# Altium project ESP32C6_module.PrjPcb
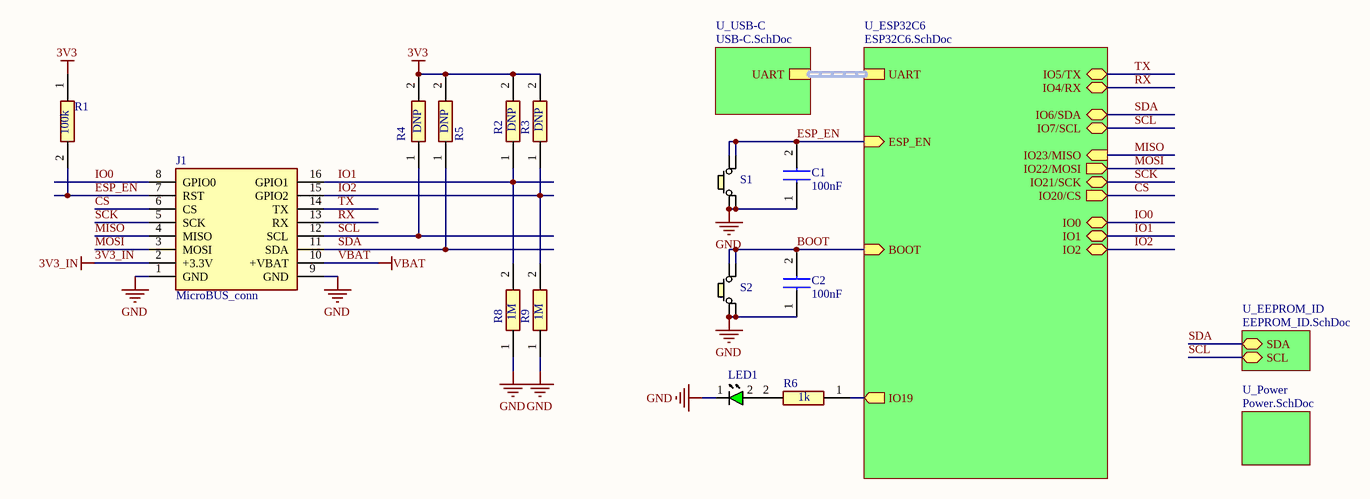
[diagram p0: main.SchDoc]
Revision: 1.3; Author: Evžen Šteif
5 sheets, 77 parts. Net scope: hierarchical (ports join the sheet entries above them; power ports are global).
Board file: ESP32C6_module.PcbDoc
Sheets:
  main.SchDoc
    U_ESP32C6 = ESP32C6.SchDoc
    U_USB-C = USB-C.SchDoc
    U_EEPROM_ID = EEPROM_ID.SchDoc
    U_Power = Power.SchDoc

## Sheet main.SchDoc: ESP
size A4; Author: Evžen Šteif; SheetNumber: 1; SheetTotal: 5

### Parts
C1  100nF  [CAPC1005X70N]
C2  100nF  [CAPC1005X70N]
J1  MicroBUS_conn  [MicroBUS_header]
LED1  150060GS75000  [LEDC1608X80N]  (value not drawn)
R1  100k  [RESC1005X35N]
R2  DNP  [RESC1005X40N]
R3  DNP  [RESC1005X40N]
R4  DNP  [RESC1005X35N]
R5  DNP  [RESC1005X35N]
R6  1k  [RESC1005X35N]
R8  1M  [RESC1005X40N]
R9  1M  [RESC1005X40N]
S1  KMR731NG_LFS  [KMR731NGLFS]  (value not drawn)
S2  KMR731NG_LFS  [KMR731NGLFS]  (value not drawn)

### Sub-sheets
U_EEPROM_ID = EEPROM_ID.SchDoc: SDA (bidir), SCL (bidir)
U_ESP32C6 = ESP32C6.SchDoc: ESP_EN (in), BOOT (in), IO21/SCK (bidir), IO22/MOSI (out), IO23/MISO (in), IO20/CS (out), IO6/SDA (bidir), IO7/SCL (bidir), IO4/RX (bidir), IO0 (bidir), IO1 (bidir), IO19 (out), UART (harness UART), IO5/TX (bidir), IO2 (bidir)
U_Power = Power.SchDoc: no entries
U_USB-C = USB-C.SchDoc: UART (harness UART)

### Nets
3V3: R1.1 R2.2 R3.2 R4.2 R5.2  [project net STAB_3V3]
3V3_IN: J1.2(+3.3V)
GND: C1.1 C2.1 J1.1(GND) J1.9(GND) LED1.1(K) R8.1 R9.1 S1.1 S1.2 S2.1 S2.2
VBAT: J1.10(+VBAT)
BOOT: C2.2 S2.3 S2.4 ; sheet U_ESP32C6/BOOT
CS: J1.6(CS) ; sheet U_ESP32C6/IO20/CS
ESP_EN: C1.2 J1.7(RST) R1.2 S1.3 S1.4 ; sheet U_ESP32C6/ESP_EN
IO0: J1.8(GPIO0) ; sheet U_ESP32C6/IO0
IO1: J1.16(GPIO1) R2.1 R8.2 ; sheet U_ESP32C6/IO1
IO2: J1.15(GPIO2) R3.1 R9.2 ; sheet U_ESP32C6/IO2
MISO: J1.4(MISO) ; sheet U_ESP32C6/IO23/MISO
MOSI: J1.3(MOSI) ; sheet U_ESP32C6/IO22/MOSI
RX: J1.13(RX) ; sheet U_ESP32C6/IO4/RX
SCK: J1.5(SCK) ; sheet U_ESP32C6/IO21/SCK
SCL: J1.12(SCL) R4.1 ; sheet U_ESP32C6/IO7/SCL, sheet U_EEPROM_ID/SCL
SDA: J1.11(SDA) R5.1 ; sheet U_ESP32C6/IO6/SDA, sheet U_EEPROM_ID/SDA
TX: J1.14(TX) ; sheet U_ESP32C6/IO5/TX
NetIC3_25: R6.1 ; sheet U_ESP32C6/IO19
NetLED1_2: LED1.2(A) R6.2

### Buses and harness runs
harness sheet U_ESP32C6/UART = sheet U_USB-C/UART

### Notes on the sheet
- Title:
- Date:
- Project:
- Type:
- Schematic
- Variant:
- Revision:
- Sheet
- of
- Author:
- Evžen Šteif
- Size:
- A4

### Library data of the parts
C1 C2 = GRM155R61A104KA01D: Capacitor; Manufacturer_Name: Murata Electronics; Datasheet Link: https://search.murata.co.jp/Ceramy/image/img/A01X/G101/ENG/GRM155R61A104KA01-02A.pdf; Height: 0.7mm; Manufacturer_Part_Number: GRM155R61A104KA01D; Mouser Part Number: 81-GRM155R61A104KA01; Mouser Price/Stock: https://www.mouser.co.uk/ProductDetail/Murata-Electronics/GRM155R61A104KA01D?qs=5bAuhL3RhmNZw0v59AqOJA%3D%3D; Arrow Part Number: GRM155R61A104KA01D; Arrow Price/Stock: https://www.arrow.com/en/products/grm155r61a104ka01d/murata-manufacturing?utm_currency=USD&region=europe
J1 = MicroBUS_conn: Connector; Manufacturer_Name: Harwin; Manufacturer_Part_Number: M20-9730845; Datasheet Link: https://cdn.harwin.com/pdfs/M20-973.pdf; Height: 9.54mm; Mouser Part Number: 855-M20-9730845; Mouser Price/Stock: https://www.mouser.co.uk/ProductDetail/Harwin/M20-9730845?qs=%252Bk6%2F5FB6qrnRfgIEPS4Dkw%3D%3D
LED1 = 150060GS75000: LED; Manufacturer_Name: Wurth Elektronik; Datasheet Link: https://componentsearchengine.com/Datasheets/2/150060GS75000.pdf; Height: 0.8mm; Manufacturer_Part_Number: 150060GS75000; Mouser Part Number: 710-150060GS75000; Mouser Price/Stock: https://www.mouser.co.uk/ProductDetail/Wurth-Elektronik/150060GS75000?qs=LlUlMxKIyB0UYkq5lDO8nA%3D%3D
R1 = RT0402FRE07100KL: Resistor; Manufacturer_Name: KEMET; Datasheet Link: https://www.yageo.com/upload/media/product/productsearch/datasheet/rchip/PYu-RT_1-to-0.01_RoHS_L_11.pdf; Height: 0.35mm; Manufacturer_Part_Number: RT0402FRE07100KL; Mouser Part Number: 603-RT0402FRE07100KL; Mouser Price/Stock: https://www.mouser.co.uk/ProductDetail/YAGEO/RT0402FRE07100KL?qs=BXCcY9r%252B08CxTvf5JB1kiw%3D%3D; Arrow Part Number: RT0402FRE07100KL; Arrow Price/Stock: https://www.arrow.com/en/products/rt0402fre07100kl/yageo
R2 R3 R8 R9 = RC0402FR-071ML: Resistor; Manufacturer_Name: YAGEO; Datasheet Link: https://componentsearchengine.com/Datasheets/2/RC0402FR-071ML.pdf; Height: 0.4mm; Manufacturer_Part_Number: RC0402FR-071ML; Mouser Part Number: 603-RC0402FR-071ML; Mouser Price/Stock: https://www.mouser.co.uk/ProductDetail/YAGEO/RC0402FR-071ML?qs=V1yeUXFNrknfoI4987wfBQ%3D%3D; Arrow Part Number: RC0402FR-071ML; Arrow Price/Stock: https://www.arrow.com/en/products/rc0402fr-071ml/yageo?region=nac
R4 R5 = RT0402FRE075K1L: Resistor; Manufacturer_Name: YAGEO; Datasheet Link: https://www.yageo.com/upload/media/product/app/datasheet/rchip/pyu-rt_1-to-0.01_rohs_l.pdf; Height: 0.35mm; Manufacturer_Part_Number: RT0402FRE075K1L; Mouser Part Number: RT0402FRE075K1L; Mouser Price/Stock: https://www.mouser.co.uk/ProductDetail/YAGEO/RT0402FRE07100RL?qs=BXCcY9r%252B08AcvLZjF7vcwQ%3D%3D
R6 = RT0402FRE071KL: Resistor; Manufacturer_Name: KEMET; Datasheet Link: https://www.yageo.com/upload/media/product/productsearch/datasheet/rchip/PYu-RT_1-to-0.01_RoHS_L_11.pdf; Height: 0.35mm; Manufacturer_Part_Number: RT0402FRE071KL; Mouser Part Number: RT0402FRE071KL; Mouser Price/Stock: https://www.mouser.co.uk/ProductDetail/YAGEO/RT0402FRE07100KL?qs=BXCcY9r%252B08CxTvf5JB1kiw%3D%3D; Arrow Part Number: RT0402FRE07100KL; Arrow Price/Stock: https://www.arrow.com/en/products/rt0402fre07100kl/yageo
S1 S2 = KMR731NG_LFS: Switch; Manufacturer_Name: C & K COMPONENTS; Manufacturer_Part_Number: KMR731NG LFS; Datasheet Link: https://www.ckswitches.com/media/1908/kmr7.pdf; Mouser Part Number: 611-KMR731NGLFS; Mouser Price/Stock: https://www.mouser.com/Search/Refine.aspx?Keyword=611-KMR731NGLFS; Arrow Part Number: KMR731NG LFS; Arrow Price/Stock: https://www.arrow.com/en/products/kmr731nglfs/ck

## Sheet ESP32C6.SchDoc
size A4; SheetNumber: 3; SheetTotal: 5
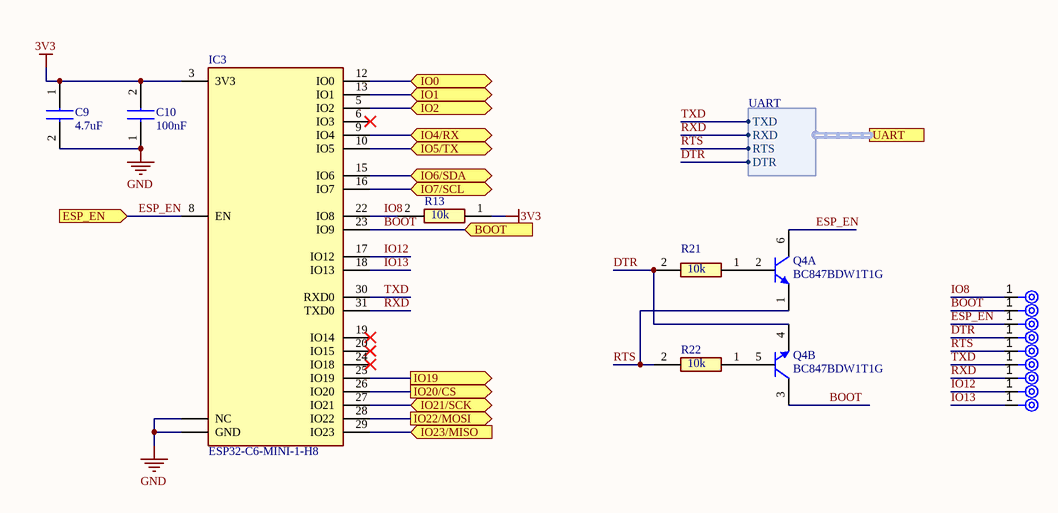
[diagram p1: ESP32C6.SchDoc]

### Parts
C9  4.7uF  [CAPC1608X90N]
C10  100nF  [CAPC1005X70N]
IC3  ESP32-C6-MINI-1-H8  [ESP32C6MINI1H8]
Q4  BC847BDW1T1G  [ONSC-SOT-363-6-419B-02_W_V]  (parts A,B of 2)
R13  10k  [RESC1005X35N]
R21  10k  [RESC1005X35N]
R22  10k  [RESC1005X35N]
TP4  TPAD6R  [TP06R]  (value not drawn)  (no BOM)
TP5  TPAD6R  [TP06R]  (value not drawn)  (no BOM)
TP6  TPAD6R  [TP06R]  (value not drawn)  (no BOM)
TP7  TPAD6R  [TP06R]  (value not drawn)  (no BOM)
TP8  TPAD6R  [TP06R]  (value not drawn)  (no BOM)
TP9  TPAD6R  [TP06R]  (value not drawn)  (no BOM)
TP10  TPAD6R  [TP06R]  (value not drawn)  (no BOM)
TP11  TPAD6R  [TP06R]  (value not drawn)  (no BOM)
TP12  TPAD6R  [TP06R]  (value not drawn)  (no BOM)

### Ports
BOOT (in, see main[3B]), ESP_EN (in, see main[3B]), IO0 (bidir, see main[4B]), IO1 (bidir, see main[4B]), IO2 (bidir, see main[4B]), IO4/RX (bidir, see main[4B]), IO5/TX (bidir, see main[4B]), IO6/SDA (bidir, see main[4B]), IO7/SCL (bidir, see main[4B]), IO19 (out, see main[3C]), IO20/CS (out, see main[4B]), IO21/SCK (bidir, see main[4B]), IO22/MOSI (out, see main[4B]), IO23/MISO (in, see main[4B]), UART (harness UART, see main[3B], USB-C[8B])

### Harnesses
UART: TXD, RXD, RTS, DTR

### Nets
3V3: C9.1 C10.2 IC3.3(3V3) R13.1  [project net STAB_3V3]
GND: C9.2 C10.1 IC3.1(GND) IC3.21(NC)
BOOT: IC3.23(IO9) Q4.3(C) TP5.1(TP) ; port BOOT
CS: IC3.26(IO20) ; port IO20/CS
DTR: Q4.4(E) R21.2 TP7.1(TP) ; port UART.DTR
ESP_EN: IC3.8(EN) Q4.6(C) TP6.1(TP) ; port ESP_EN
IO0: IC3.12(IO0) ; port IO0
IO1: IC3.13(IO1) ; port IO1
IO2: IC3.5(IO2) ; port IO2
IO8: IC3.22(IO8) R13.2 TP4.1(TP)
IO12: IC3.17(IO12) TP11.1(TP)
IO13: IC3.18(IO13) TP12.1(TP)
MISO: IC3.29(IO23) ; port IO23/MISO
MOSI: IC3.28(IO22) ; port IO22/MOSI
RTS: Q4.1(E) R22.2 TP8.1(TP) ; port UART.RTS
RX: IC3.9(IO4) ; port IO4/RX
RXD: IC3.31(TXD0) TP10.1(TP) ; port UART.RXD
SCK: IC3.27(IO21) ; port IO21/SCK
SCL: IC3.16(IO7) ; port IO7/SCL
SDA: IC3.15(IO6) ; port IO6/SDA
TX: IC3.10(IO5) ; port IO5/TX
TXD: IC3.30(RXD0) TP9.1(TP) ; port UART.TXD
NetIC3_25: IC3.25(IO19) ; port IO19
NetQ4_2: Q4.2(B) R21.1
NetQ4_5: Q4.5(B) R22.1

Not connected (* = marked no-connect by the designer): IC3 6(IO3)* 19(IO14)* 20(IO15)* 24(IO18)*

### Notes on the sheet
- Title:
- Date:
- Project:
- Type:
- Schematic
- Variant:
- Revision:
- Sheet
- of
- Author:
- Evžen Šteif
- Size:
- A4

### Library data of the parts
C9 = GRM188R61E475KE11J: Capacitor; Manufacturer_Name: Murata Electronics; Datasheet Link: https://search.murata.co.jp/Ceramy/image/img/A01X/G101/ENG/GRM188R61E475KE11-01A.pdf; Height: 0.9mm; Manufacturer_Part_Number: GRM188R61E475KE11J; Mouser Part Number: 81-GRM188R61E475KE1J; Mouser Price/Stock: https://www.mouser.co.uk/ProductDetail/Murata-Electronics/GRM188R61E475KE11J?qs=hNud%2FORuBR3%2Fa9GLJFT8KA%3D%3D; Arrow Part Number: GRM188R61E475KE11J; Arrow Price/Stock: https://www.arrow.com/en/products/grm188r61e475ke11j/murata-manufacturing
C10 = GRM155R61A104KA01D: as C1 on sheet main; Datasheet Link: https://search.murata.co.jp/Ceramy/image/img/A01X/G101/ENG/GRM155R61A104KA01-02A.pdf; Height: 0.7mm; Manufacturer_Part_Number: GRM155R61A104KA01D; Mouser Part Number: 81-GRM155R61A104KA01; Mouser Price/Stock: https://www.mouser.co.uk/ProductDetail/Murata-Electronics/GRM155R61A104KA01D?qs=5bAuhL3RhmNZw0v59AqOJA%3D%3D; Arrow Part Number: GRM155R61A104KA01D; Arrow Price/Stock: https://www.arrow.com/en/products/grm155r61a104ka01d/murata-manufacturing?utm_currency=USD&region=europe
IC3 = ESP32-C6-MINI-1-H8: Integrated Circuit; pin to pad: 1>PGND 21>NC; Manufacturer_Name: Espressif Systems; Datasheet Link: https://www.mouser.ph/ProductDetail/Espressif-Systems/ESP32-C6-MINI-1-H8?qs=olJun0bQHM8q1UR%2FHSWi2A%3D%3D; Height: 2.55mm; Manufacturer_Part_Number: ESP32-C6-MINI-1-H8; Mouser Part Number: 356-ESP32C6MINI1H8; Mouser Price/Stock: https://www.mouser.co.uk/ProductDetail/Espressif-Systems/ESP32-C6-MINI-1-H8?qs=olJun0bQHM8q1UR%2FHSWi2A%3D%3D
Q4 = CMP-1048-00875-1: Dual General Purpose Transistors, NPN, 6-Pin SOT-363, Pb-Free, Tape and Reel; Manufacturer: On Semiconductor; fT Min (MHz): 100; IC Continuous (A): 0.1; Polarity: Dual NPN; ComponentLink3Description: Package Specification; PackageReference: SOT-363-6-419B-02_W; RoHS: TRUE; PackageVersion: Rev. W, 01/2006; Packing: Tape and Reel; Mounting Technology: Surface Mount; ComponentLink3URL: http://www.onsemi.com/pub_link/Collateral/NTJD4001N-D.PDF; ComponentLink2URL: http://www.onsemi.cn/pub_link/Collateral/BC846BDW1T1-D.PDF; ComponentLink2Description: Datasheet; ComponentLink1Description: Manufacturer URL; PartNumber: BC847BDW1T1G; DatasheetVersion: Rev. 9; PackageDescription: 6-Pin Small Outline Transistor, Body 2 x 1.25 mm, Pitch 0.65 mm; ComponentLink1URL: http://www.onsemi.com/
R13 R21 R22 = RT0402FRE0710KL: Resistor; Manufacturer_Name: KEMET; Datasheet Link: https://cz.mouser.com/datasheet/2/447/PYu_RT_1_to_0_01_RoHS_L_15-3461507.pdf; Height: 0.35mm; Manufacturer_Part_Number: RT0402FRE0710KL; Mouser Part Number: 603-RT0402FRE0710KL; Mouser Price/Stock: https://www.mouser.co.uk/ProductDetail/YAGEO/RT0402FRE07100KL?qs=BXCcY9r%252B08CxTvf5JB1kiw%3D%3D; Arrow Part Number: RT0402FRE07100KL; Arrow Price/Stock: https://www.arrow.com/en/products/rt0402fre07100kl/yageo
TP4-TP12 = CMP-00028-00002-2: 0.6mm round; Pins: 1

## Sheet USB-C.SchDoc
size A3; SheetNumber: 4; SheetTotal: 5
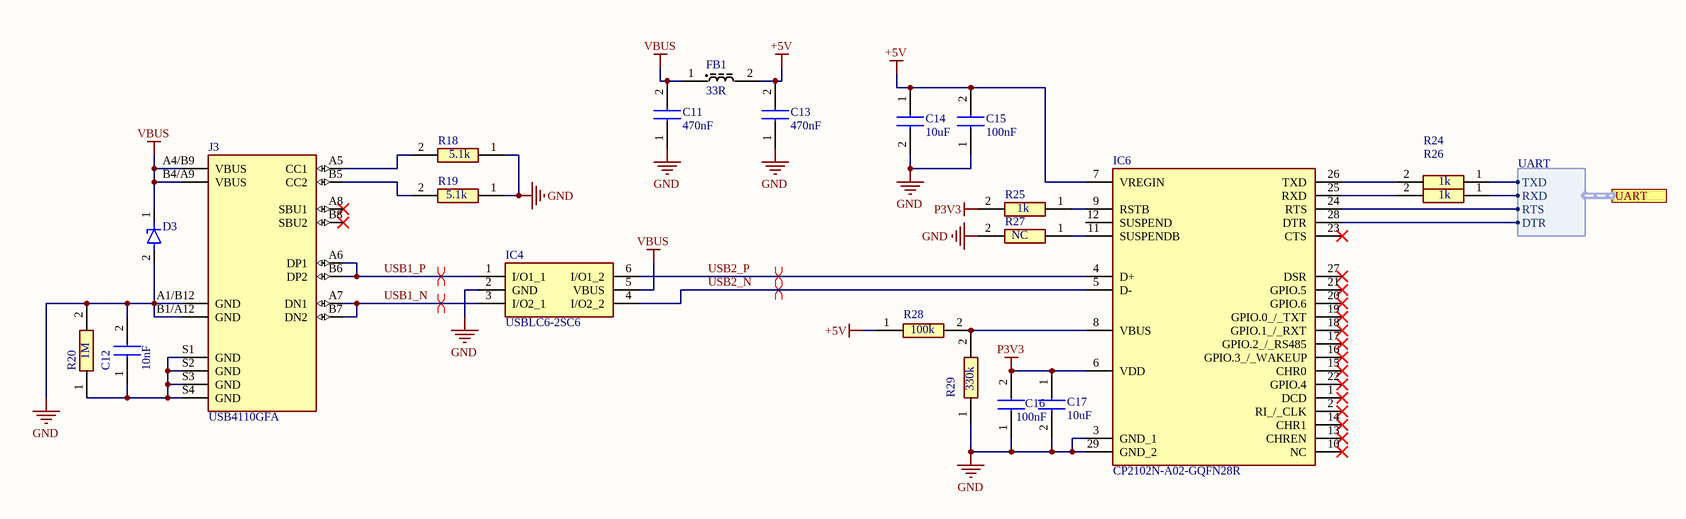
[diagram p2: USB-C.SchDoc]

### Parts
C11  470nF  [GRM15x]
C12  10nF  [GRM15x]
C13  470nF  [GRM15x]
C14  10uF  [GRM18x]
C15  100nF  [CAPC1005X70N]
C16  100nF  [CAPC1005X70N]
C17  10uF  [GRM18x]
D3  ESDA25P35-1U1M  [ESDA25P351U1M]  (value not drawn)
FB1  33R  [BLM18SP221SN1B]
IC4  USBLC6-2SC6  [SOT95P280X145-6N]
IC6  CP2102N-A02-GQFN28R  [QFN50P500X500X80-29N-D]
J3  USB4110GFA  [GCT_USB4110GFA]
R18  5.1k  [RESC1005X35N]
R19  5.1k  [RESC1005X35N]
R20  1M  [RESC1005X40N]
R24  1k  [RESC1005X35N]
R25  1k  [RESC1005X35N]
R26  1k  [RESC1005X35N]
R27  NC  [RESC1005X35N]
R28  100k  [RESC1005X40N]
R29  330k  [RESC1005X40N]

### Ports
UART (harness UART, see main[3B], ESP32C6[3B])

### Harnesses
UART: TXD, RXD, RTS, DTR

### Nets
+5V: C13.2 C14.1 C15.2 FB1.2 IC6.7(VREGIN) R28.1
GND: C11.1 C12.2 C13.1 C14.2 C15.1 C16.1 C17.2 D3.2(A) IC4.2(GND) IC6.3(GND_1) IC6.29(GND_2) J3.A1/B12(GND) J3.B1/A12(GND) R18.1 R19.1 R20.2 R27.2 R29.1
P3V3: C16.2 C17.1 IC6.6(VDD) R25.2
VBUS: C11.2 D3.1(K) FB1.1 IC4.5(VBUS) J3.A4/B9(VBUS) J3.B4/A9(VBUS)
DTR: IC6.28(DTR) ; port UART.DTR
RTS: IC6.24(RTS) ; port UART.RTS
RXD: R26.1 ; port UART.RXD
TXD: R24.1 ; port UART.TXD
USB1_N: IC4.3(I/O2_1) J3.A7(DN1) J3.B7(DN2)
USB1_P: IC4.1(I/O1_1) J3.A6(DP1) J3.B6(DP2)
USB2_N: IC4.4(I/O2_2) IC6.5(D-)
USB2_P: IC4.6(I/O1_2) IC6.4(D+)
NetC12_1: C12.1 J3.S1(GND) J3.S2(GND) J3.S3(GND) J3.S4(GND) R20.1
NetIC6_8: IC6.8(VBUS) R28.2 R29.2
NetIC6_9: IC6.9(RSTB) R25.1
NetIC6_11: IC6.11(SUSPENDB) R27.1
NetIC6_25: IC6.25(RXD) R26.2
NetIC6_26: IC6.26(TXD) R24.2
NetJ3_A5: J3.A5(CC1) R18.2
NetJ3_B5: J3.B5(CC2) R19.2

Not connected (* = marked no-connect by the designer): IC6 1(DCD)* 2(RI_/_CLK)* 10(NC)* 12(SUSPEND) 13(CHREN)* 14(CHR1)* 15(CHR0)* 16(GPIO.3_/_WAKEUP)* 17(GPIO.2_/_RS485)* 18(GPIO.1_/_RXT)* 19(GPIO.0_/_TXT)* 20(GPIO.6)* 21(GPIO.5)* 22(GPIO.4)* 23(CTS)* 27(DSR)*; J3 A8(SBU1)* B8(SBU2)*

### Layout directives
differential pair; differential pair class USB; net class USB: USB1_N, USB1_P, USB2_N, USB2_P

### Notes on the sheet
- Title:
- Date:
- Project:
- Type:
- Schematic
- Variant:
- Revision:
- Sheet
- of
- Author:
- Evžen Šteif
- Size:
- A4

### Library data of the parts
C11 C13 = GRM155R61H474KE11J: Capacitor; Manufacturer_Name: Murata Electronics; Datasheet Link: https://search.murata.co.jp/Ceramy/image/img/A01X/G101/ENG/GRM155R61H474KE11-01A.pdf; Height: 0.33mm; Manufacturer_Part_Number: GRM155R61H474KE11J; Mouser Part Number: 81-GRM155R61H474KE1J; Mouser Price/Stock: https://www.mouser.co.uk/ProductDetail/Murata-Electronics/GRM155R61H474KE11J?qs=lEfY3O89AqlWLR2W%252BlOiGQ%3D%3D
C12 = GRM155R71H103KA88D: Capacitor; Manufacturer_Name: Murata Electronics; Datasheet Link: https://search.murata.co.jp/Ceramy/image/img/A01X/G101/ENG/GRM155R71H103KA88-01A.pdf; Height: 0.33mm; Manufacturer_Part_Number: GRM155R71H103KA88D; Mouser Part Number: 81-GRM155R71H103KA8D; Mouser Price/Stock: https://www.mouser.co.uk/ProductDetail/Murata-Electronics/GRM155R71H103KA88D?qs=Dfh4SrgScWxOVlCuzd3ZyQ%3D%3D; Arrow Part Number: GRM155R71H103KA88D; Arrow Price/Stock: https://www.arrow.com/en/products/grm155r71h103ka88d/murata-manufacturing?utm_currency=USD&region=nac
C14 C17 = GRM188R61E106KA73D: Capacitor; Manufacturer_Name: Murata Electronics; Datasheet Link: https://search.murata.co.jp/Ceramy/image/img/A01X/G101/ENG/GRM188R61E106KA73-01A.pdf; Height: 0.9mm; Manufacturer_Part_Number: GRM188R61E106KA73D; Mouser Part Number: 81-GRM188R61E106KA3D; Mouser Price/Stock: https://www.mouser.co.uk/ProductDetail/Murata-Electronics/GRM188R61E106KA73D?qs=5aG0NVq1C4z8ebxPkQZf9A%3D%3D; Arrow Part Number: GRM188R61E106KA73D; Arrow Price/Stock: https://www.arrow.com/en/products/grm188r61e106ka73d/murata-manufacturing?region=nac
C15 C16 = GRM155R61A104KA01D: as C1 on sheet main; Datasheet Link: https://search.murata.co.jp/Ceramy/image/img/A01X/G101/ENG/GRM155R61A104KA01-02A.pdf; Height: 0.7mm; Manufacturer_Part_Number: GRM155R61A104KA01D; Mouser Part Number: 81-GRM155R61A104KA01; Mouser Price/Stock: https://www.mouser.co.uk/ProductDetail/Murata-Electronics/GRM155R61A104KA01D?qs=5bAuhL3RhmNZw0v59AqOJA%3D%3D; Arrow Part Number: GRM155R61A104KA01D; Arrow Price/Stock: https://www.arrow.com/en/products/grm155r61a104ka01d/murata-manufacturing?utm_currency=USD&region=europe
D3 = ESDA25P35-1U1M: TVS Diode (Uni-directional); Manufacturer_Name: STMicroelectronics; Datasheet Link: https://www.st.com/resource/en/datasheet/esda25p35-1u1m.pdf; Height: 0.6mm; Manufacturer_Part_Number: ESDA25P35-1U1M; Mouser Part Number: 511-ESDA25P35-1U1M; Mouser Price/Stock: https://www.mouser.co.uk/ProductDetail/STMicroelectronics/ESDA25P35-1U1M?qs=aVyJF2WnouQUWqgNP85ZrA%3D%3D; Arrow Part Number: ESDA25P35-1U1M; Arrow Price/Stock: https://www.arrow.com/en/products/esda25p35-1u1m/stmicroelectronics?utm_currency=USD&region=europe
FB1 = BLM18SG330SN1D: Ferrite Bead; Manufacturer_Name: Murata Electronics; Datasheet Link: http://www.murata.com/~/media/webrenewal/support/library/catalog/products/emc/emifil/c31e.ashx?la=en-gb; Height: 0.95mm; Manufacturer_Part_Number: BLM18SG330SN1D; Mouser Part Number: 81-BLM18SG330SN1D; Mouser Price/Stock: https://www.mouser.co.uk/ProductDetail/Murata-Electronics/BLM18SG330SN1D?qs=7EBvPakHacUT88safgvlfQ%3D%3D; Arrow Part Number: BLM18SG330SN1D; Arrow Price/Stock: https://www.arrow.com/en/products/blm18sg330sn1d/murata-manufacturing
IC4 = USBLC6-2SC6: Integrated Circuit; Manufacturer_Name: STMicroelectronics; Datasheet Link: http://www.st.com/st-web-ui/static/active/en/resource/technical/document/datasheet/CD00050750.pdf; Height: 1.45mm; Manufacturer_Part_Number: USBLC6-2SC6; Mouser Part Number: 511-USBLC6-2SC6; Mouser Price/Stock: https://www.mouser.co.uk/ProductDetail/STMicroelectronics/USBLC6-2SC6?qs=po45yt2pPpu%2FhNIlwQdTlg%3D%3D; Arrow Part Number: USBLC6-2SC6; Arrow Price/Stock: https://www.arrow.com/en/products/usblc6-2sc6/stmicroelectronics?utm_currency=USD&region=europe
IC6 = CP2102N-A02-GQFN28R: Integrated Circuit; Manufacturer_Name: Silicon Labs; Datasheet Link: https://www.silabs.com/documents/public/data-sheets/cp2102n-datasheet.pdf; Height: 0.8mm; Manufacturer_Part_Number: CP2102N-A02-GQFN28R; Mouser Part Number: 634-CP2102NA02QFN28R; Mouser Price/Stock: https://www.mouser.co.uk/ProductDetail/Silicon-Labs/CP2102N-A02-GQFN28R?qs=u16ybLDytRag4qKvSH3fTw%3D%3D; Arrow Part Number: CP2102N-A02-GQFN28R; Arrow Price/Stock: https://www.arrow.com/en/products/cp2102n-a02-gqfn28r/silicon-labs?utm_currency=USD&region=nac
J3 = USB4110GFA: USB-C (USB TYPE-C) USB 2.0 Receptacle Connector 24 (16+8 Dummy) Position Surface Mount, Right Angle; MF: Global Connector Technology; SnapEDA_Link: https://www.snapeda.com/parts/USB4110GFA/Global+Connector+Technology/view-part/?ref=snap; Package: None; Value: *; MP: USB4110GFA; Check_prices: https://www.snapeda.com/parts/USB4110GFA/Global+Connector+Technology/view-part/?ref=eda
R18 R19 = RT0402FRE075K1L: Resistor; Manufacturer_Name: YAGEO; Datasheet Link: https://www.yageo.com/upload/media/product/app/datasheet/rchip/pyu-rt_1-to-0.01_rohs_l.pdf; Height: 0.35mm; Manufacturer_Part_Number: RT0402FRE075K1L; Mouser Part Number: RT0402FRE075K1L; Mouser Price/Stock: https://www.mouser.co.uk/ProductDetail/YAGEO/RT0402FRE07100RL?qs=BXCcY9r%252B08AcvLZjF7vcwQ%3D%3D
R20 = RC0402FR-071ML: Resistor; Manufacturer_Name: YAGEO; Datasheet Link: https://componentsearchengine.com/Datasheets/2/RC0402FR-071ML.pdf; Height: 0.4mm; Manufacturer_Part_Number: RC0402FR-071ML; Mouser Part Number: 603-RC0402FR-071ML; Mouser Price/Stock: https://www.mouser.co.uk/ProductDetail/YAGEO/RC0402FR-071ML?qs=V1yeUXFNrknfoI4987wfBQ%3D%3D; Arrow Part Number: RC0402FR-071ML; Arrow Price/Stock: https://www.arrow.com/en/products/rc0402fr-071ml/yageo?region=nac
R24-R26 = RT0402FRE071KL: Resistor; Manufacturer_Name: KEMET; Datasheet Link: https://www.yageo.com/upload/media/product/productsearch/datasheet/rchip/PYu-RT_1-to-0.01_RoHS_L_11.pdf; Height: 0.35mm; Manufacturer_Part_Number: RT0402FRE071KL; Mouser Part Number: RT0402FRE071KL; Mouser Price/Stock: https://www.mouser.co.uk/ProductDetail/YAGEO/RT0402FRE07100KL?qs=BXCcY9r%252B08CxTvf5JB1kiw%3D%3D; Arrow Part Number: RT0402FRE07100KL; Arrow Price/Stock: https://www.arrow.com/en/products/rt0402fre07100kl/yageo
R27 = RT0402FRE0710KL: Resistor; Manufacturer_Name: KEMET; Datasheet Link: https://cz.mouser.com/datasheet/2/447/PYu_RT_1_to_0_01_RoHS_L_15-3461507.pdf; Height: 0.35mm; Manufacturer_Part_Number: RT0402FRE0710KL; Mouser Part Number: 603-RT0402FRE0710KL; Mouser Price/Stock: https://www.mouser.co.uk/ProductDetail/YAGEO/RT0402FRE07100KL?qs=BXCcY9r%252B08CxTvf5JB1kiw%3D%3D; Arrow Part Number: RT0402FRE07100KL; Arrow Price/Stock: https://www.arrow.com/en/products/rt0402fre07100kl/yageo
R28 = RC0402BR-07100KL: Resistor; Manufacturer_Name: YAGEO; Datasheet Link: https://cz.mouser.com/datasheet/2/447/PYu_RC_Group_51_RoHS_L_12-3368608.pdf; Height: 0.4mm; Manufacturer_Part_Number: RC0402BR-07100KL
R29 = RC0402BR-07330KL: Resistor; Manufacturer_Name: YAGEO; Datasheet Link: https://cz.mouser.com/datasheet/2/447/PYu_RC_Group_51_RoHS_L_11-1984063.pdf; Height: 0.4mm; Manufacturer_Part_Number: RC0402BR-07330KL

## Sheet EEPROM_ID.SchDoc
size A4; SheetNumber: 5; SheetTotal: 5
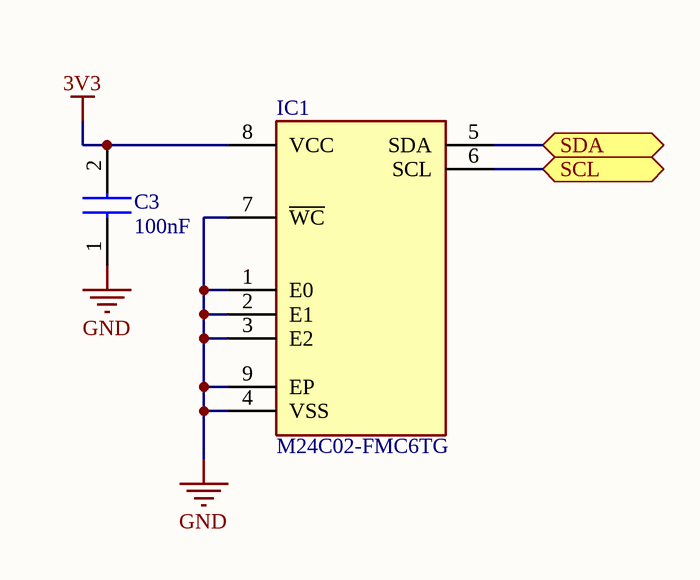
[diagram p3: EEPROM_ID.SchDoc]

### Parts
C3  100nF  [CAPC1005X70N]
IC1  M24C02-FMC6TG  [M24C02FMC6TG]

### Ports
SCL (bidir, see main[4C]), SDA (bidir, see main[4C])

### Nets
3V3: C3.2 IC1.8(VCC)  [project net STAB_3V3]
GND: C3.1 IC1.1(E0) IC1.2(E1) IC1.3(E2) IC1.4(VSS) IC1.7(~{WC}) IC1.9(EP)
SCL: IC1.6(SCL) ; port SCL
SDA: IC1.5(SDA) ; port SDA

### Notes on the sheet
- Title:
- Date:
- Project:
- Type:
- Schematic
- Variant:
- Revision:
- Sheet
- of
- Author:
- Evžen Šteif
- Size:
- A4

### Library data of the parts
C3 = GRM155R61A104KA01D: as C1 on sheet main; Datasheet Link: https://search.murata.co.jp/Ceramy/image/img/A01X/G101/ENG/GRM155R61A104KA01-02A.pdf; Height: 0.7mm; Manufacturer_Part_Number: GRM155R61A104KA01D; Mouser Part Number: 81-GRM155R61A104KA01; Mouser Price/Stock: https://www.mouser.co.uk/ProductDetail/Murata-Electronics/GRM155R61A104KA01D?qs=5bAuhL3RhmNZw0v59AqOJA%3D%3D; Arrow Part Number: GRM155R61A104KA01D; Arrow Price/Stock: https://www.arrow.com/en/products/grm155r61a104ka01d/murata-manufacturing?utm_currency=USD&region=europe
IC1 = M24C02-FMC6TG: Integrated Circuit; Manufacturer_Name: STMicroelectronics; Datasheet Link: https://www.st.com/resource/en/datasheet/m24c01-r.pdf; Height: 0.6mm; Manufacturer_Part_Number: M24C02-FMC6TG; Mouser Part Number: 511-M24C02-FMC6TG; Mouser Price/Stock: https://www.mouser.co.uk/ProductDetail/STMicroelectronics/M24C02-FMC6TG?qs=WHlX%252B%252B9%2FRwB%252BxJ8bQxWbzQ%3D%3D; Arrow Part Number: M24C02-FMC6TG; Arrow Price/Stock: https://www.arrow.com/en/products/m24c02-fmc6tg/stmicroelectronics?region=nac

## Sheet Power.SchDoc
size A4; SheetNumber: 2; SheetTotal: 5
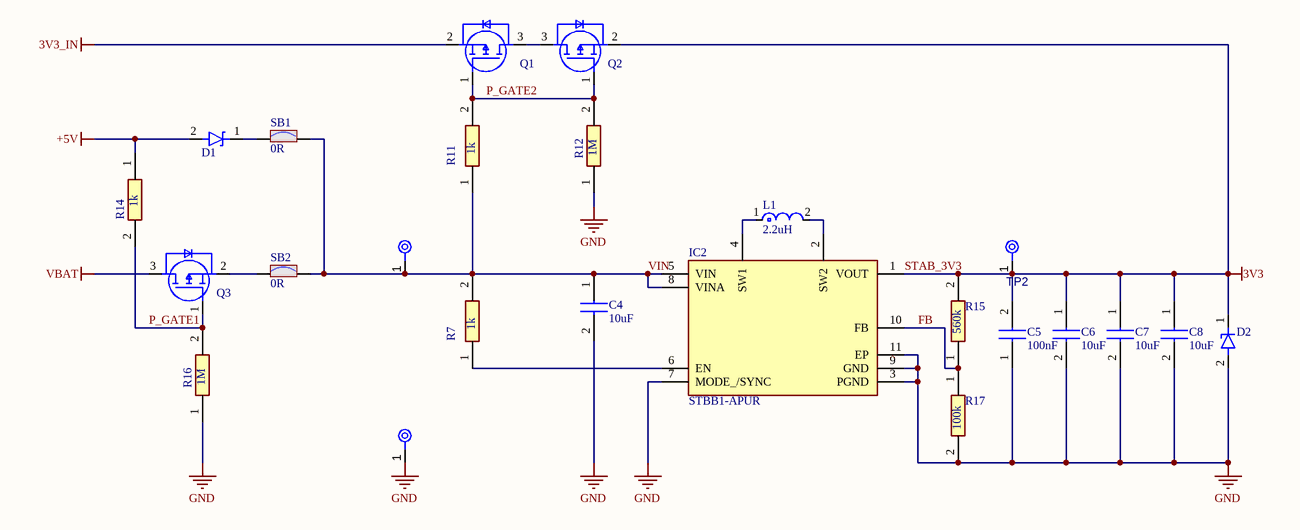
[diagram p4: Power.SchDoc]

### Parts
C4  10uF  [GRM18x]
C5  100nF  [CAPC1005X70N]
C6  10uF  [GRM18x]
C7  10uF  [GRM18x]
C8  10uF  [GRM18x]
D1  RB168MM-40TFTR  [RB168MM40TFTR]  (value not drawn)
D2  SP3205-01ETG  [SP320501ETG]  (value not drawn)
IC2  STBB1-APUR  [SON50P300X300X100-11N-D]
L1  2.2uH  [FP-XFL4020-MFG]
Q1  SSM3J358R,LF  [SOTFL95P240X88-3N]  (value not drawn)
Q2  SSM3J358R,LF  [SOTFL95P240X88-3N]  (value not drawn)
Q3  SSM3J358R,LF  [SOTFL95P240X88-3N]  (value not drawn)
R7  1k  [RESC1005X35N]
R11  1k  [RESC1005X35N]
R12  1M  [RESC1005X40N]
R14  1k  [RESC1005X35N]
R15  560k  [RESC1005X40N]
R16  1M  [RESC1005X40N]
R17  100k  [RESC1005X40N]
SB1  value 0R  [SOLDER-BRIDGE_R0603-0R]  (hidden comment: SB_ON)
SB2  value 0R  [SOLDER-BRIDGE_R0603-0R]  (hidden comment: SB_ON)
TP1  TPAD6R  [TP06R]  (value not drawn)  (no BOM)
TP2  TPAD6R  [TP06R]  (value not drawn)  (no BOM)
TP3  TPAD6R  [TP06R]  (value not drawn)  (no BOM)

### Nets
3V3_IN: Q1.2(S)
+5V: D1.2(A) R14.1
GND: C4.2 C5.1 C6.2 C7.2 C8.2 D2.2(A) IC2.3(PGND) IC2.7(MODE_/SYNC) IC2.9(GND) IC2.11(EP) R12.1 R16.1 R17.2 TP3.1(TP)
STAB_3V3: C5.2 C6.1 C7.1 C8.1 D2.1(K) IC2.1(VOUT) Q2.2(S) R15.2 TP2.1(TP)  [also labelled 3V3]
VBAT: Q3.3(D)
FB: IC2.10(FB) R15.1 R17.1
P_GATE1: Q3.1(G) R14.2 R16.2
P_GATE2: Q1.1(G) Q2.1(G) R11.2 R12.2
VIN: C4.1 IC2.5(VIN) IC2.8(VINA) R7.2 R11.1 SB1.2 SB2.2 TP1.1(TP)
NetD1_1: D1.1(K) SB1.1
NetIC2_2: IC2.2(SW2) L1.2
NetIC2_4: IC2.4(SW1) L1.1
NetIC2_6: IC2.6(EN) R7.1
NetQ1_3: Q1.3(D) Q2.3(D)
NetQ3_2: Q3.2(S) SB2.1

### Notes on the sheet
- Title:
- Date:
- Project:
- Type:
- Schematic
- Variant:
- Revision:
- Sheet
- of
- Author:
- Evžen Šteif
- Size:
- A4

### Library data of the parts
C4 C6-C8 = GRM188R61E106KA73D: as C14 on sheet USB-C; Datasheet Link: https://search.murata.co.jp/Ceramy/image/img/A01X/G101/ENG/GRM188R61E106KA73-01A.pdf; Height: 0.9mm; Manufacturer_Part_Number: GRM188R61E106KA73D; Mouser Part Number: 81-GRM188R61E106KA3D; Mouser Price/Stock: https://www.mouser.co.uk/ProductDetail/Murata-Electronics/GRM188R61E106KA73D?qs=5aG0NVq1C4z8ebxPkQZf9A%3D%3D; Arrow Part Number: GRM188R61E106KA73D; Arrow Price/Stock: https://www.arrow.com/en/products/grm188r61e106ka73d/murata-manufacturing?region=nac
C5 = GRM155R61A104KA01D: as C1 on sheet main; Datasheet Link: https://search.murata.co.jp/Ceramy/image/img/A01X/G101/ENG/GRM155R61A104KA01-02A.pdf; Height: 0.7mm; Manufacturer_Part_Number: GRM155R61A104KA01D; Mouser Part Number: 81-GRM155R61A104KA01; Mouser Price/Stock: https://www.mouser.co.uk/ProductDetail/Murata-Electronics/GRM155R61A104KA01D?qs=5bAuhL3RhmNZw0v59AqOJA%3D%3D; Arrow Part Number: GRM155R61A104KA01D; Arrow Price/Stock: https://www.arrow.com/en/products/grm155r61a104ka01d/murata-manufacturing?utm_currency=USD&region=europe
D1 = RB168MM-40TFTR: Schottky Diode; Manufacturer_Name: ROHM Semiconductor; Datasheet Link: https://www.rohm.com/products/diodes/schottky-barrier-diodes/ultra-low-ir/rb168mm-40tf-product#productDetail; Height: 0.9mm; Manufacturer_Part_Number: RB168MM-40TFTR; Mouser Part Number: 755-RB168MM-40TFTR; Mouser Price/Stock: https://www.mouser.co.uk/ProductDetail/ROHM-Semiconductor/RB168MM-40TFTR?qs=4v%252BiZTmLVHGRj2i7xya%2FtQ%3D%3D
D2 = SP3205-01ETG: Diode ESD (Uni-directional); Manufacturer_Name: LITTELFUSE; Datasheet Link: https://4donline.ihs.com/images/VipMasterIC/IC/LFSI/LFSI-S-A0010724013/LFSI-S-A0010724013-1.pdf?hkey=6D3A4C79FDBF58556ACFDE234799DDF0; Height: 0.55mm; Manufacturer_Part_Number: SP3205-01ETG; Mouser Part Number: 576-SP3205-01ETG; Mouser Price/Stock: https://www.mouser.co.uk/ProductDetail/Littelfuse/SP3205-01ETG?qs=vHuUswq2%252BswfNhVD4WkB%252BQ%3D%3D; Arrow Part Number: SP3205-01ETG; Arrow Price/Stock: https://www.arrow.com/en/products/sp3205-01etg/littelfuse?utm_currency=USD&region=nac
IC2 = STBB1-APUR: Integrated Circuit; Manufacturer_Name: STMicroelectronics; Datasheet Link: https://www.st.com/resource/en/datasheet/stbb1-axx.pdf; Height: 1mm; Manufacturer_Part_Number: STBB1-APUR; Mouser Part Number: 511-STBB1-APUR; Mouser Price/Stock: https://www.mouser.co.uk/ProductDetail/STMicroelectronics/STBB1-APUR?qs=XoSzFQ8izGZfZqn873o0Mg%3D%3D; Arrow Part Number: STBB1-APUR; Arrow Price/Stock: https://www.arrow.com/en/products/stbb1-apur/stmicroelectronics?utm_currency=USD&region=nac
L1 = CMP-2000-05090-4: INDUCTOR, 2.2UH, 8A, 20%, 38MHZ, REEL; Test Frequency: 100kHz; Shielding: Shielded; Saturation Current: 3.1A; DC Resistance (DCR): 23.5mR; Core Material: Composite; Height: 2.1mm; Width: 4.3mm; Mount: Surface Mount; RMS Current (Irms): 8A; Case/Package: SMD/SMT; Length: 4.3mm; REACH SVHC: No SVHC; Max DC Current: 8A; Min Operating Temperature: -40°C; Series: XFL4020; Self Resonant Frequency: 38MHz; Inductance Tolerance: 20%; Lead Free: Contains Lead; Tolerance: 20%; RoHS Compliant: Yes; Termination: SMD/SMT; Packaging: Tape and Reel; Max Operating Temperature: 125°C; Inductance: 2.2uH
Q1-Q3 = SSM3J358R,LF: MOSFET (P-Channel); Manufacturer_Name: Toshiba; Datasheet Link: https://toshiba.semicon-storage.com/ap-en/product/mosfet/detail.SSM3J358R.html; Height: 0.88mm; Manufacturer_Part_Number: SSM3J358R,LF; Mouser Part Number: 757-SSM3J358RLF; Mouser Price/Stock: https://www.mouser.co.uk/ProductDetail/Toshiba/SSM3J358RLF?qs=HXFqYaX1Q2xwvCtt1GGmkw%3D%3D; Arrow Part Number: SSM3J358R,LF; Arrow Price/Stock: https://www.arrow.com/en/products/ssm3j358rlf/toshiba?region=nac
R7 R11 R14 = RT0402FRE071KL: Resistor; Manufacturer_Name: KEMET; Datasheet Link: https://www.yageo.com/upload/media/product/productsearch/datasheet/rchip/PYu-RT_1-to-0.01_RoHS_L_11.pdf; Height: 0.35mm; Manufacturer_Part_Number: RT0402FRE071KL; Mouser Part Number: RT0402FRE071KL; Mouser Price/Stock: https://www.mouser.co.uk/ProductDetail/YAGEO/RT0402FRE07100KL?qs=BXCcY9r%252B08CxTvf5JB1kiw%3D%3D; Arrow Part Number: RT0402FRE07100KL; Arrow Price/Stock: https://www.arrow.com/en/products/rt0402fre07100kl/yageo
R12 R16 = RC0402FR-071ML: Resistor; Manufacturer_Name: YAGEO; Datasheet Link: https://componentsearchengine.com/Datasheets/2/RC0402FR-071ML.pdf; Height: 0.4mm; Manufacturer_Part_Number: RC0402FR-071ML; Mouser Part Number: 603-RC0402FR-071ML; Mouser Price/Stock: https://www.mouser.co.uk/ProductDetail/YAGEO/RC0402FR-071ML?qs=V1yeUXFNrknfoI4987wfBQ%3D%3D; Arrow Part Number: RC0402FR-071ML; Arrow Price/Stock: https://www.arrow.com/en/products/rc0402fr-071ml/yageo?region=nac
R15 = RE0402BRE07560KL: Resistor; Manufacturer_Name: YAGEO; Datasheet Link: https://cz.mouser.com/datasheet/3/508/1/pyu-re_105_rohs_l.pdf; Height: 0.4mm; Manufacturer_Part_Number: RE0402BRE07560KL
R17 = RC0402BR-07100KL: Resistor; Manufacturer_Name: YAGEO; Datasheet Link: https://cz.mouser.com/datasheet/2/447/PYu_RC_Group_51_RoHS_L_12-3368608.pdf; Height: 0.4mm; Manufacturer_Part_Number: RC0402BR-07100KL
SB1 SB2 = MCD-00071: Resistor, 0R, SB0603, 5%, 0.1W; Manufacturer_Part_Number: RC0603JR-070RL; Manufacturer: YAGEO; Part_Preference: Recommended; Manufacturer_HQ_COO: Unknown; ShowFields: YES; ID: 2521; Order_Code_RS: 199-5647; Component_Country_Of_Origin: China; Internal_Part_Number: MCD-00071; Status: Released; Part_Type: Resistor; Package: 0603; ComponentLink1URL: http://tunmcdsvn.tun.st.com/Component_Documentation_Library/Trunk/Resistor/YAGEO_RC_Series; Order_Code_Digikey: 311-0.0GRTR-ND; Order_Code_Farnell: 2421846
TP1-TP3 = CMP-00028-00002-2: 0.6mm round; Pins: 1

## Nets that join several sheets
3V3_IN: main (J1.2), Power (Q1.2)
+5V: USB-C (6 pins), Power (D1.2 R14.1)
GND: main (11 pins), ESP32C6 (C9.2 C10.1 IC3.1 IC3.21), USB-C (18 pins), EEPROM_ID (7 pins), Power (14 pins)
STAB_3V3: main (5 pins), ESP32C6 (C9.1 C10.2 IC3.3 R13.1), EEPROM_ID (C3.2 IC1.8), Power (9 pins)
VBAT: main (J1.10), Power (Q3.3)
BOOT: main (C2.2 S2.3 S2.4), ESP32C6 (IC3.23 Q4.3 TP5.1)
CS: main (J1.6), ESP32C6 (IC3.26)
DTR: ESP32C6 (Q4.4 R21.2 TP7.1), USB-C (IC6.28)
ESP_EN: main (5 pins), ESP32C6 (IC3.8 Q4.6 TP6.1)
IO0: main (J1.8), ESP32C6 (IC3.12)
IO1: main (J1.16 R2.1 R8.2), ESP32C6 (IC3.13)
IO2: main (J1.15 R3.1 R9.2), ESP32C6 (IC3.5)
MISO: main (J1.4), ESP32C6 (IC3.29)
MOSI: main (J1.3), ESP32C6 (IC3.28)
NetIC3_25: main (R6.1), ESP32C6 (IC3.25)
RTS: ESP32C6 (Q4.1 R22.2 TP8.1), USB-C (IC6.24)
RX: main (J1.13), ESP32C6 (IC3.9)
RXD: ESP32C6 (IC3.31 TP10.1), USB-C (R26.1)
SCK: main (J1.5), ESP32C6 (IC3.27)
SCL: main (J1.12 R4.1), ESP32C6 (IC3.16), EEPROM_ID (IC1.6)
SDA: main (J1.11 R5.1), ESP32C6 (IC3.15), EEPROM_ID (IC1.5)
TX: main (J1.14), ESP32C6 (IC3.10)
TXD: ESP32C6 (IC3.30 TP9.1), USB-C (R24.1)

## Assembly variants
ESP32C6_module_assembly: not fitted C? R? R? R? R? R? R? R?